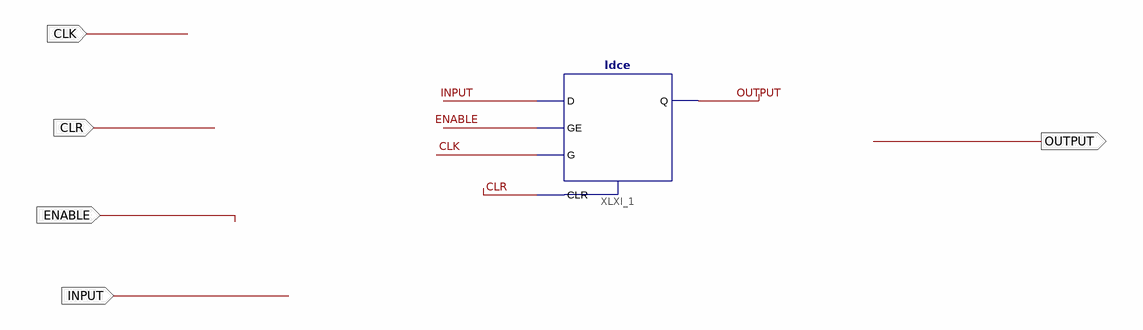
[diagram p0: schematic sheet 1]
// Xilinx ISE schematic LATCH1.sch (artix7) as structural Verilog: 1 symbols, 5 ports
module LATCH1 (
  input  CLK,
  input  CLR,
  input  ENABLE,
  input  INPUT,
  output OUTPUT
);

  ldce XLXI_1 (.CLR(CLR), .D(INPUT), .G(CLK), .GE(ENABLE), .Q(OUTPUT));
endmodule
